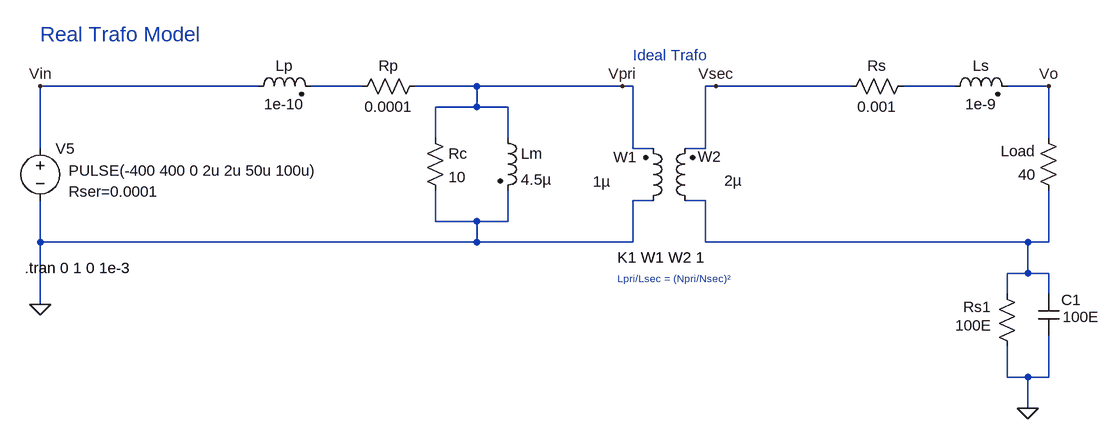
[diagram p0: schematic Trafo.asc]
Trafo.asc, the LTspice schematic file:
Version 4.1
SHEET 1 2692 3464
WIRE -2672 1824 -3008 1824
WIRE -2512 1824 -2592 1824
WIRE -2336 1824 -2432 1824
WIRE -2112 1824 -2336 1824
WIRE -2096 1824 -2112 1824
WIRE -1968 1824 -1984 1824
WIRE -1760 1824 -1968 1824
WIRE -1600 1824 -1680 1824
WIRE -1456 1824 -1520 1824
WIRE -2336 1856 -2336 1824
WIRE -2336 1856 -2400 1856
WIRE -2288 1856 -2336 1856
WIRE -2400 1904 -2400 1856
WIRE -2288 1904 -2288 1856
WIRE -1456 1904 -1456 1824
WIRE -3008 1920 -3008 1824
WIRE -2096 1920 -2096 1824
WIRE -2064 1920 -2096 1920
WIRE -1984 1920 -1984 1824
WIRE -1984 1920 -2016 1920
WIRE -2064 2000 -2096 2000
WIRE -1984 2000 -2016 2000
WIRE -2400 2032 -2400 1984
WIRE -2336 2032 -2400 2032
WIRE -2288 2032 -2288 1984
WIRE -2288 2032 -2336 2032
WIRE -3008 2064 -3008 2000
WIRE -2336 2064 -2336 2032
WIRE -2336 2064 -3008 2064
WIRE -2096 2064 -2096 2000
WIRE -2096 2064 -2336 2064
WIRE -1984 2064 -1984 2000
WIRE -1488 2064 -1984 2064
WIRE -1456 2064 -1456 1984
WIRE -1456 2064 -1488 2064
WIRE -1488 2112 -1488 2064
WIRE -1488 2112 -1520 2112
WIRE -1456 2112 -1488 2112
WIRE -1520 2144 -1520 2112
WIRE -1456 2144 -1456 2112
WIRE -3008 2160 -3008 2064
WIRE -1520 2272 -1520 2224
WIRE -1488 2272 -1520 2272
WIRE -1456 2272 -1456 2208
WIRE -1456 2272 -1488 2272
WIRE -1488 2320 -1488 2272
FLAG -3008 2160 0
FLAG -3008 1824 Vin
FLAG -2112 1824 Vpri
FLAG -1968 1824 Vsec
FLAG -1456 1824 Vo
FLAG -1488 2320 0
SYMBOL voltage -3008 1904 R0
WINDOW 3 44 50 Left 2
WINDOW 123 24 44 Left 2
WINDOW 39 44 82 Left 2
SYMATTR Value PULSE(-400 400 0 2u 2u 50u 100u)
SYMATTR SpiceLine Rser=0.0001
SYMATTR InstName V5
SYMBOL ind2 -2000 2016 R180
WINDOW 0 -40 84 Left 2
WINDOW 3 -72 47 Left 2
SYMATTR InstName W2
SYMATTR Value 2µ
SYMATTR Type ind
SYMATTR SpiceLine Ipk=40 Rser=0 Rpar=0 Cpar=0
SYMBOL ind2 -2080 2016 M180
WINDOW 0 -46 83 Left 2
WINDOW 3 -77 45 Left 2
SYMATTR InstName W1
SYMATTR Value 1µ
SYMATTR Type ind
SYMATTR SpiceLine Ipk=40 Rser=0 Rpar=0 Cpar=0
SYMBOL ind2 -2304 1888 R0
SYMATTR InstName Lm
SYMATTR Value 4.5µ
SYMATTR Type ind
SYMATTR SpiceLine Ipk=40 Rser=1e-10 Rpar=0 Cpar=0
SYMBOL res -2416 1888 R0
SYMATTR InstName Rc
SYMATTR Value 10
SYMBOL res -2416 1808 R90
WINDOW 0 0 56 VBottom 2
WINDOW 3 32 56 VTop 2
SYMATTR InstName Rp
SYMATTR Value 0.0001
SYMBOL ind2 -2688 1840 R270
WINDOW 0 32 56 VTop 2
WINDOW 3 4 56 VBottom 2
SYMATTR InstName Lp
SYMATTR Value 1e-10
SYMATTR Type ind
SYMATTR SpiceLine Ipk=40 Rser=0 Rpar=0 Cpar=0
SYMBOL res -1664 1808 R90
WINDOW 0 0 56 VBottom 2
WINDOW 3 32 56 VTop 2
SYMATTR InstName Rs
SYMATTR Value 0.001
SYMBOL ind2 -1616 1840 R270
WINDOW 0 32 56 VTop 2
WINDOW 3 4 56 VBottom 2
SYMATTR InstName Ls
SYMATTR Value 1e-9
SYMATTR Type ind
SYMATTR SpiceLine Ipk=40 Rser=0 Rpar=0 Cpar=0
SYMBOL res -1536 2128 R0
WINDOW 0 -51 36 Left 2
WINDOW 3 102 51 Left 2
SYMATTR InstName Rs1
SYMATTR Value 100E
SYMBOL cap -1440 2208 R180
WINDOW 0 -34 55 Left 2
WINDOW 3 103 16 Left 2
SYMATTR InstName C1
SYMATTR Value 100E
SYMBOL res -1440 2000 R180
WINDOW 0 36 76 Left 2
WINDOW 3 36 40 Left 2
SYMATTR InstName Load
SYMATTR Value 40
TEXT -3008 1744 Left 3 ;Real Trafo Model
TEXT -3032 2104 Left 2 !.tran 0 1 0 1e-3
TEXT -2120 2088 Left 2 !K1 W1 W2 1
TEXT -2120 2120 Left 1 ;Lpri/Lsec = (Npri/Nsec)²
TEXT -2096 1776 Left 2 ;Ideal Trafo

The netlist it stands for:
* Trafo.asc
V5 Vin 0 PULSE(-400 400 0 2u 2u 50u 100u) Rser=0.0001
L§W2 N003 Vsec 2µ Ipk=40 Rser=0 Rpar=0 Cpar=0
L§W1 0 Vpri 1µ Ipk=40 Rser=0 Rpar=0 Cpar=0
Lm Vpri 0 4.5µ Ipk=40 Rser=1e-10 Rpar=0 Cpar=0
Rc Vpri 0 10
Rp Vpri N001 0.0001
Lp Vin N001 1e-10 Ipk=40 Rser=0 Rpar=0 Cpar=0
Rs N002 Vsec 0.001
Ls N002 Vo 1e-9 Ipk=40 Rser=0 Rpar=0 Cpar=0
Rs1 N003 0 100E
C1 0 N003 100E
R§Load N003 Vo 40
* Real Trafo Model
.tran 0 1 0 1e-3
K1 W1 W2 1
* Lpri/Lsec = (Npri/Nsec)²
* Ideal Trafo
.backanno
.end